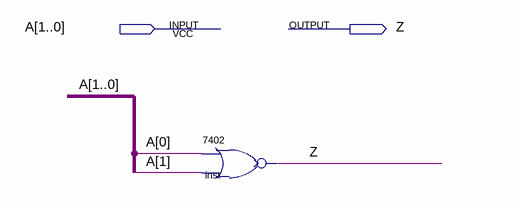
[diagram p0: schematic sheet]
// Quartus schematic nor_2in.bdf as structural Verilog: 1 symbols, 2 pins
module nor_2in (
  input  [1:0] A,
  output Z
);

  \7402  inst (.\2 (A[0]), .\3 (A[1]), .\1 (Z));
endmodule
